# Altium schematic sheet sensors.SchDoc
size A4
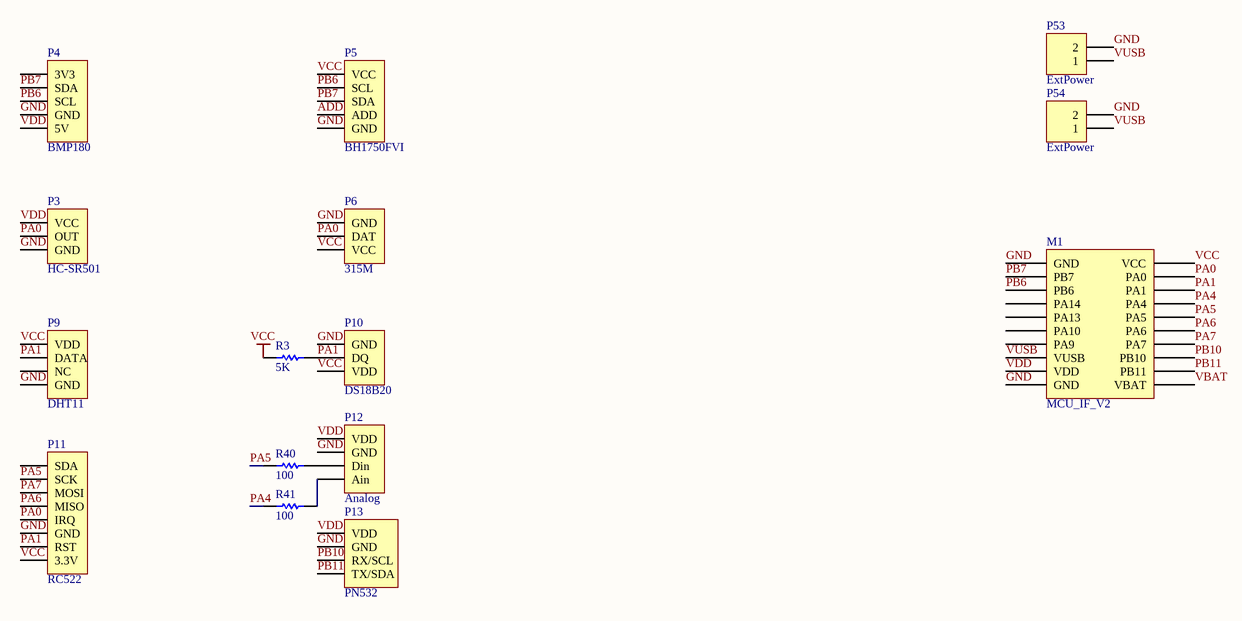
[diagram p0: sensors.SchDoc]

## Parts
M1  MCU_IF_V2  [MCU_IF_V2]
P3  HC-SR501  [HDR1X3]
P4  BMP180  [HDR1X5]
P5  BH1750FVI  [HDR1X5]
P6  315M  [HDR1X3]
P9  DHT11  [HDR1X4]
P10  DS18B20  [HDR1X3]
P11  RC522  [HDR1X8]
P12  Analog  [HDR1X4]
P13  PN532  [HDR1X4]
P53  ExtPower  [HDR1X2H]
P54  ExtPower  [HDR1X2H]
R3  value 5K  [R-1608[0603]]  (hidden comment: Res Semi)
R40  value 100  [R-1608[0603]]  (hidden comment: Res Semi)
R41  value 100  [R-1608[0603]]  (hidden comment: Res Semi)

## Nets
VCC: M1.20(VCC) P5.1(VCC) P6.3(VCC) P9.1(VDD) P10.3(VDD) P11.8(3.3V) R3.1
ADD: P5.4(ADD)
GND: M1.1(GND) M1.10(GND) P3.3(GND) P4.4(GND) P5.5(GND) P6.1(GND) P9.4(GND) P10.1(GND) P11.6(GND) P12.2(GND) P13.2(GND) P53.2 P54.2
PA0: M1.19(PA0) P3.2(OUT) P6.2(DAT) P11.5(IRQ)
PA1: M1.18(PA1) P9.2(DATA) P10.2(DQ) P11.7(RST) R3.2
PA4: M1.17(PA4) R41.1
PA5: M1.16(PA5) P11.2(SCK) R40.1
PA6: M1.15(PA6) P11.4(MISO)
PA7: M1.14(PA7) P11.3(MOSI)
PB6: M1.3(PB6) P4.3(SCL) P5.2(SCL)
PB7: M1.2(PB7) P4.2(SDA) P5.3(SDA)
PB10: M1.13(PB10) P13.3(RX/SCL)
PB11: M1.12(PB11) P13.4(TX/SDA)
VBAT: M1.11(VBAT)
VDD: M1.9(VDD) P3.1(VCC) P4.5(5V) P12.1(VDD) P13.1(VDD)
VUSB: M1.8(VUSB) P53.1 P54.1
NetP12_3: P12.3(Din) R40.2
NetP12_4: P12.4(Ain) R41.2

Not connected (* = marked no-connect by the designer): M1 4(PA14) 5(PA13) 6(PA10) 7(PA9); P4 1(3V3); P9 3(NC); P11 1(SDA)

## Library data of the parts
M1 = MCU_IF_V1
P3 = HC-SR501: Header, 3-Pin; LatestRevisionDate: 17-Jul-2002; LatestRevisionNote: Re-released for DXP Platform.; Publisher: Altium Limited
P4 = BMP180: Header, 5-Pin; LatestRevisionDate: 17-Jul-2002; LatestRevisionNote: Re-released for DXP Platform.; Publisher: Altium Limited
P6 = 315M: Header, 3-Pin; LatestRevisionDate: 17-Jul-2002; LatestRevisionNote: Re-released for DXP Platform.; Publisher: Altium Limited
P9 = DHT11: Header, 4-Pin; LatestRevisionDate: 17-Jul-2002; LatestRevisionNote: Re-released for DXP Platform.; Publisher: Altium Limited
P10 = DS18B20: Header, 3-Pin; LatestRevisionDate: 17-Jul-2002; LatestRevisionNote: Re-released for DXP Platform.; Publisher: Altium Limited
P11 = RC522: Header, 8-Pin; LatestRevisionDate: 17-Jul-2002; LatestRevisionNote: Re-released for DXP Platform.; Publisher: Altium Limited
P12 = Analog: Header, 4-Pin; LatestRevisionDate: 17-Jul-2002; LatestRevisionNote: Re-released for DXP Platform.; Publisher: Altium Limited
P13 = PN532: Header, 4-Pin; LatestRevisionDate: 17-Jul-2002; LatestRevisionNote: Re-released for DXP Platform.; Publisher: Altium Limited
P53 P54 = Header 2H: Header, 2-Pin, Right Angle; LatestRevisionDate: 17-Jul-2002; LatestRevisionNote: Re-released for DXP Platform.; Publisher: Altium Limited
R3 R40 R41 = Res Semi: Semiconductor Resistor; Published: 8-Jun-2000; LatestRevisionDate: 17-Jul-2002; LatestRevisionNote: Re-released for DXP Platform.; PackageReference: AXIAL-0.5; Publisher: Altium Limited
P5 = BH1750FVI: LatestRevisionDate: 17-Jul-2002; LatestRevisionNote: Re-released for DXP Platform.; Publisher: Altium Limited